# EasyEDA Pro project 减速无刷电机FOC1.0.epro, schematic Schematic1
Create Date: 2024-04-05; Page Name: P1; Project Name: 减速无刷电机FOC; Schematic Name: Schematic1; Update Date: 2024-04-06; Company: 嘉立创EDA; Page Size: A3; Version: V1.0
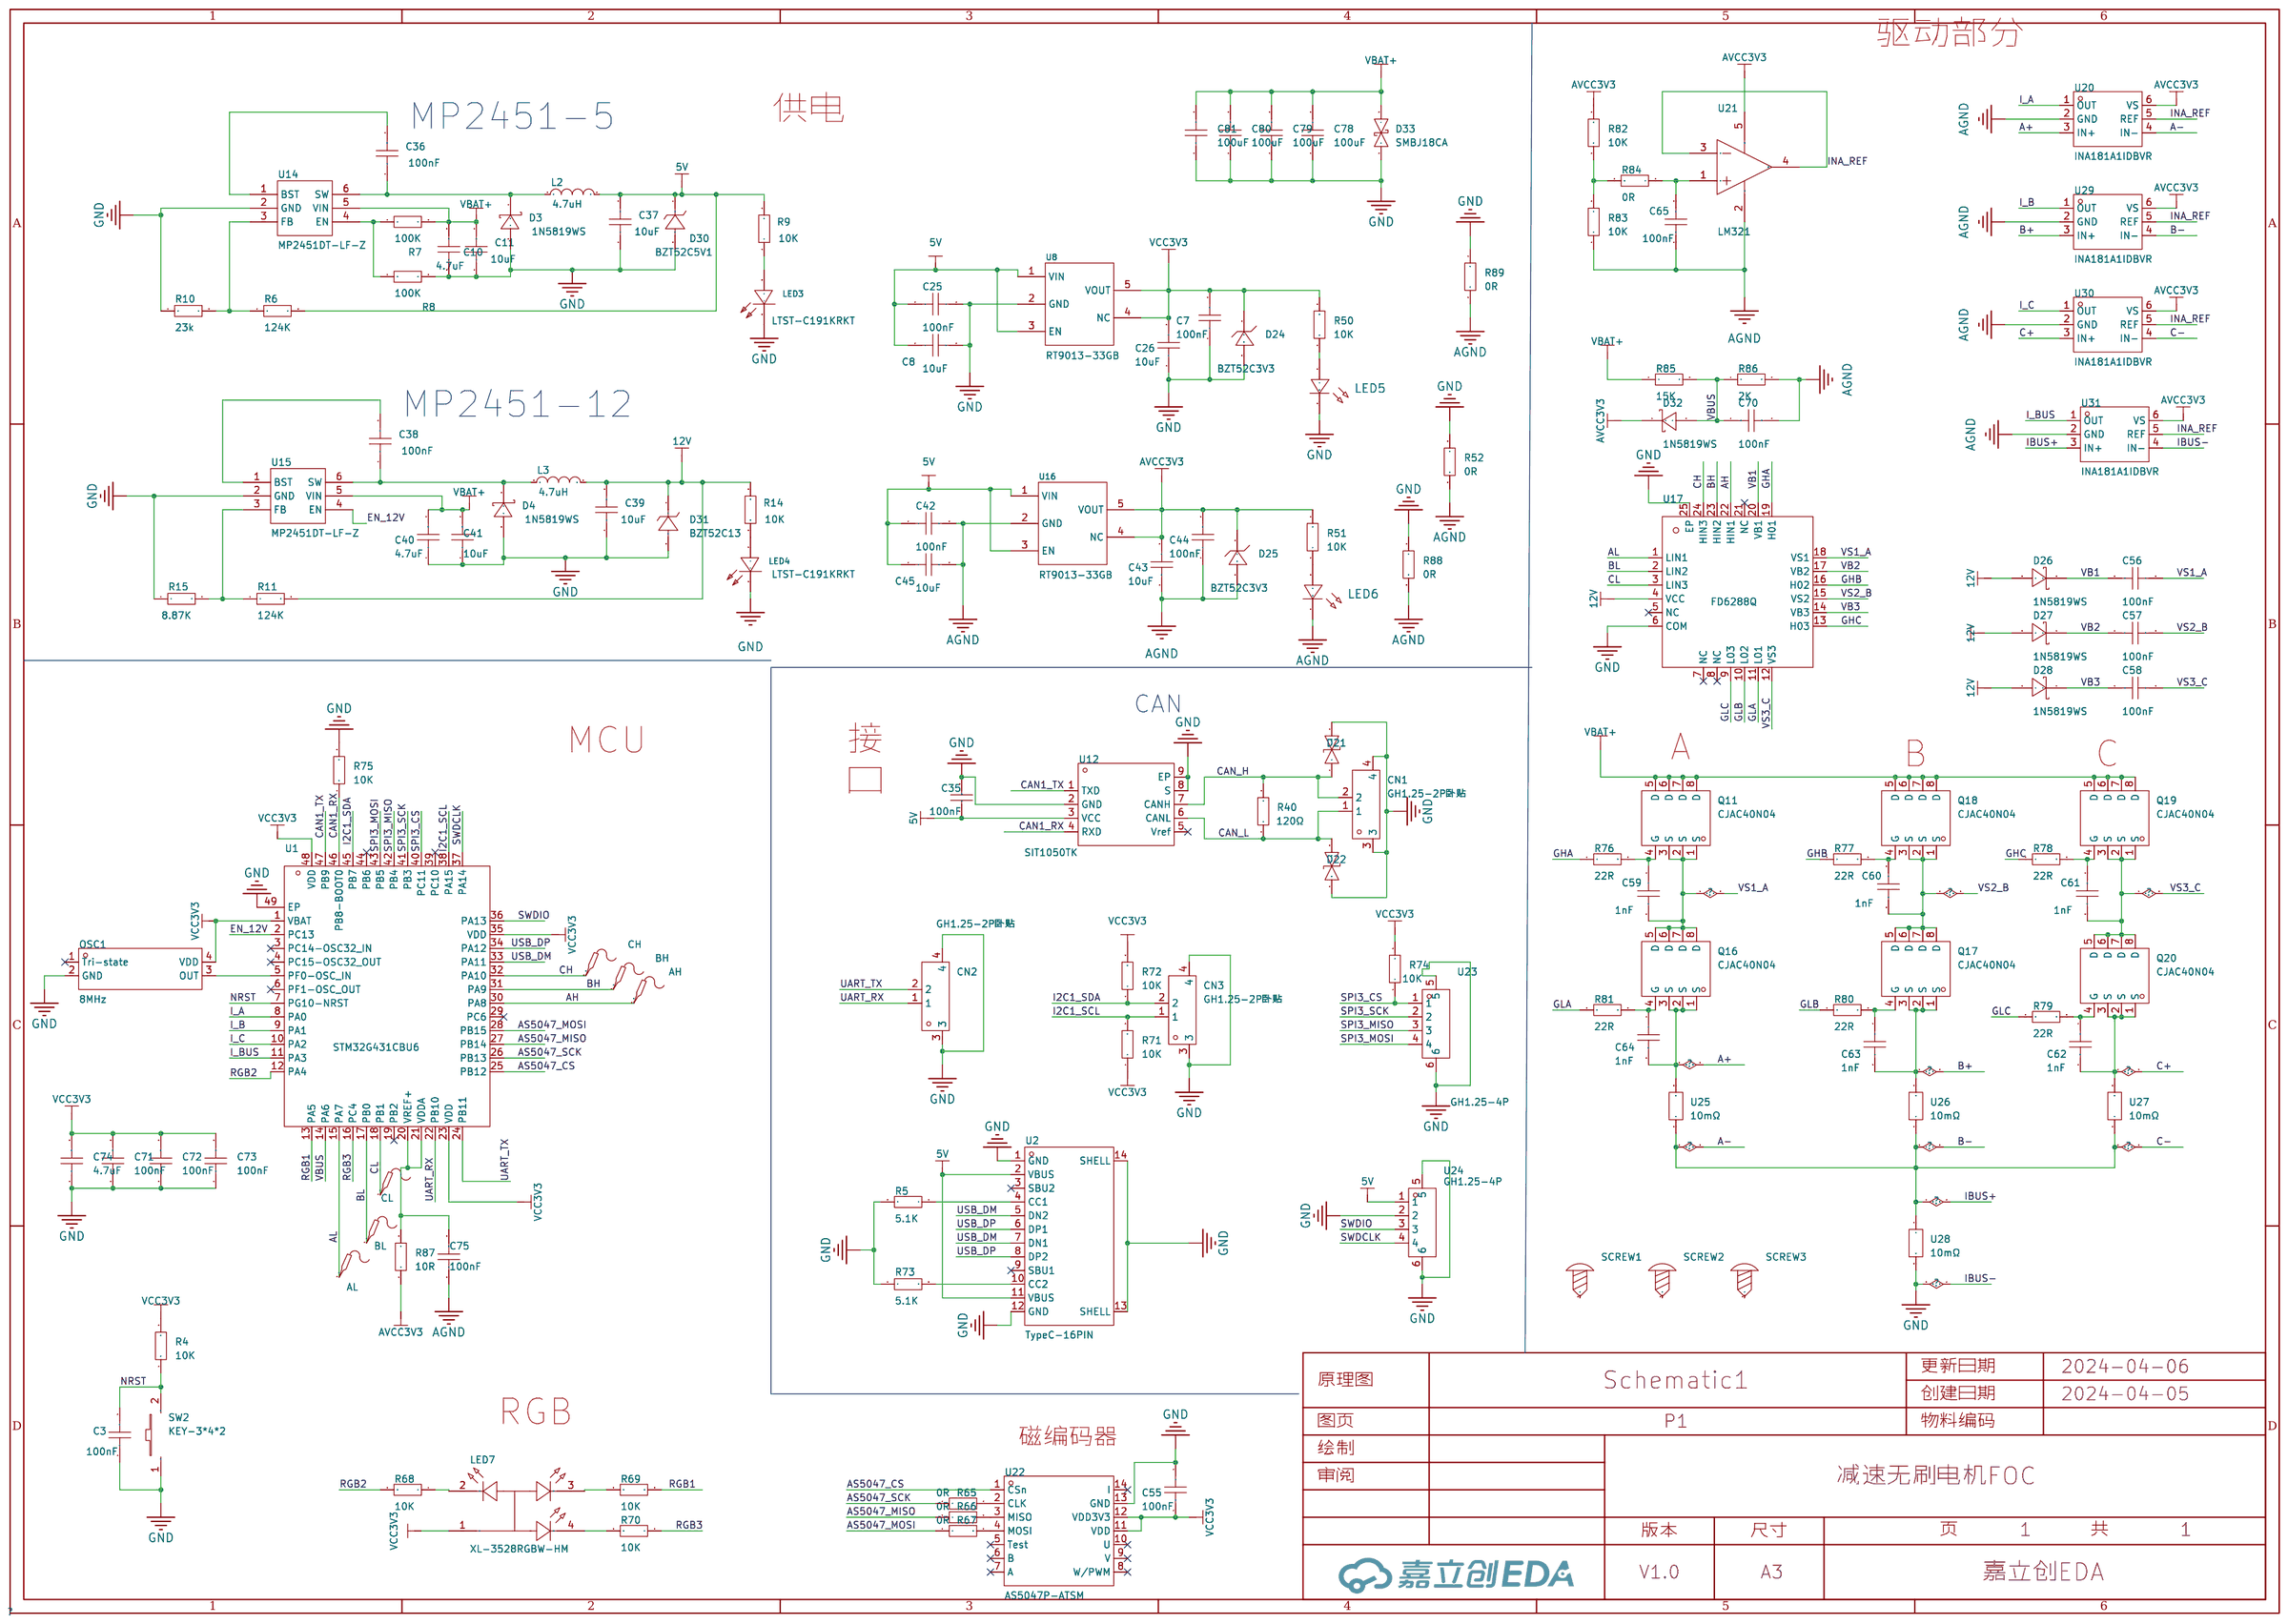
[diagram p0: schematic sheet]

## Parts
AH  -  [Test-Point-0.5mm]
AL  -  [Test-Point-0.5mm]
BH  -  [Test-Point-0.5mm]
BL  -  [Test-Point-0.5mm]
C3  100nF  [C0402]
C7  100nF  [C0603]
C8  10uF  [C0603]
C10  4.7uF  [C0603]
C11  10uF  [C0603]
C25  100nF  [C0603]
C26  10uF  [C0603]
C35  100nF  [C0603]
C36  100nF  [C0603]
C37  10uF  [C0603]
C38  100nF  [C0603]
C39  10uF  [C0603]
C40  4.7uF  [C0603]
C41  10uF  [C0603]
C42  100nF  [C0603]
C43  10uF  [C0603]
C44  100nF  [C0603]
C45  10uF  [C0603]
C55  100nF  [C0603]
C56  100nF  [C0603]
C57  100nF  [C0603]
C58  100nF  [C0603]
C59  1nF  [C0603]
C60  1nF  [C0603]
C61  1nF  [C0603]
C62  1nF  [C0603]
C63  1nF  [C0603]
C64  1nF  [C0603]
C65  100nF  [C0603]
C70  100nF  [C0603]
C71  100nF  [C0402]
C72  100nF  [C0402]
C73  100nF  [C0402]
C74  4.7uF  [C0402]
C75  100nF  [C0402]
C78  100uF  [C1206]
C79  100uF  [C1206]
C80  100uF  [C1206]
C81  100uF  [C1206]
CH  -  [Test-Point-0.5mm]
CL  -  [Test-Point-0.5mm]
CN1  GH1.25-2P卧贴  [CONN-SMD_2P-P1.25_X1251WRS-02HF-LPSW]
CN2  GH1.25-2P卧贴  [CONN-SMD_2P-P1.25_X1251WRS-02HF-LPSW]
CN3  GH1.25-2P卧贴  [CONN-SMD_2P-P1.25_X1251WRS-02HF-LPSW]
D3  1N5819WS  [SOD-323_L1.8-W1.3-LS2.5-RD]
D4  1N5819WS  [SOD-323_L1.8-W1.3-LS2.5-RD]
D21  PESD3V3L1BA-N  [SOD-323_L1.8-W1.3-LS2.5-BI]
D22  PESD3V3L1BA-N  [SOD-323_L1.8-W1.3-LS2.5-BI]
D24  BZT52C3V3  [SOD-123_L2.7-W1.6-LS3.7-RD-1]
D25  BZT52C3V3  [SOD-123_L2.7-W1.6-LS3.7-RD-1]
D26  1N5819WS  [SOD-323_L1.8-W1.3-LS2.5-RD]
D27  1N5819WS  [SOD-323_L1.8-W1.3-LS2.5-RD]
D28  1N5819WS  [SOD-323_L1.8-W1.3-LS2.5-RD]
D30  BZT52C5V1  [SOD-123_L2.8-W1.8-LS3.7-RD-1]
D31  BZT52C13  [SOD-123_L2.7-W1.6-LS3.7-RD-1]
D32  1N5819WS  [SOD-323_L1.8-W1.3-LS2.5-RD]
D33  SMBJ18CA  [SMB_L4.6-W3.6-LS5.3-BI]
L2  4.7uH  [IND-SMD_L5.2-W4.7_GPSR0520]
L3  4.7uH  [IND-SMD_L5.2-W4.7_GPSR0520]
LED3  LTST-C191KRKT  [LED0603-RD]
LED4  LTST-C191KRKT  [LED0603-RD]
LED5  -  [LED_0402]
LED6  -  [LED_0402]
LED7  XL-3528RGBW-HM  [LED-SMD_4P-L3.2-W2.8-LS3.5-BL-CW]
OSC1  8MHz  [OSC-SMD_4P-L3.2-W2.5-BL-1]
Q11  CJAC40N04  [CY_PDFNWB-8L_L5.8-W4.9-P1.27-BL-EP]
Q16  CJAC40N04  [CY_PDFNWB-8L_L5.8-W4.9-P1.27-BL-EP]
Q17  CJAC40N04  [CY_PDFNWB-8L_L5.8-W4.9-P1.27-BL-EP]
Q18  CJAC40N04  [CY_PDFNWB-8L_L5.8-W4.9-P1.27-BL-EP]
Q19  CJAC40N04  [CY_PDFNWB-8L_L5.8-W4.9-P1.27-BL-EP]
Q20  CJAC40N04  [CY_PDFNWB-8L_L5.8-W4.9-P1.27-BL-EP]
R4  10K  [R0402]
R5  5.1K  [R0603]
R6  124K  [R0603]
R7  100K  [R0603]
R8  100K  [R0603]
R9  10K  [R0603]
R10  23k  [R0603]
R11  124K  [R0603]
R14  10K  [R0603]
R15  8.87K  [R0603]
R40  120Ω  [R0603]
R50  10K  [R0402]
R51  10K  [R0402]
R52  0R  [R0402]
R65  0R  [R0402]
R66  0R  [R0402]
R67  0R  [R0402]
R68  10K  [R0402]
R69  10K  [R0402]
R70  10K  [R0402]
R71  10K  [R0603]
R72  10K  [R0603]
R73  5.1K  [R0603]
R74  10K  [R0603]
R75  10K  [R0603]
R76  22R  [R0603]
R77  22R  [R0603]
R78  22R  [R0603]
R79  22R  [R0603]
R80  22R  [R0603]
R81  22R  [R0603]
R82  10K  [R0603]
R83  10K  [R0603]
R84  0R  [R0603]
R85  15K  [R0603]
R86  2K  [R0603]
R87  10R  [R0402]
R88  0R  [R0402]
R89  0R  [R0402]
SCREW1  -  [M3螺丝]
SCREW2  -  [M3螺丝]
SCREW3  -  [M3螺丝]
SW2  KEY-3*4*2  [SW-SMD_L4.0-W2.9-LS5.0]
U1  STM32G431CBU6  [UFQFPN-48_L7.0-W7.0-P0.50-BL-EP]
U2  TypeC-16PIN  [USB-C-SMD_TYPE-C-6PIN-2MD-073]
U8  RT9013-33GB  [SOT-23-5_L3.0-W1.7-P0.95-LS2.8-BL]
U12  SIT1050TK  [TDFN-8_L3.0-W3.0-P0.65-BL-EP]
U14  MP2451DT-LF-Z  [SOT-23-6_L2.9-W1.6-P0.95-LS2.8-BR]
U15  MP2451DT-LF-Z  [SOT-23-6_L2.9-W1.6-P0.95-LS2.8-BR]
U16  RT9013-33GB  [SOT-23-5_L3.0-W1.7-P0.95-LS2.8-BL]
U17  FD6288Q  [QFN-24_L4.0-W4.0-P0.50-BL-EP2.7]
U20  INA181A1IDBVR  [SOT-23-6_L2.9-W1.6-P0.95-LS2.8-TL]
U21  LM321  [SOT-23-5_L2.9-W1.6-P0.95-LS2.8-BR]
U22  AS5047P-ATSM  [TSSOP-14_L5.0-W4.4-P0.65-LS6.4-BL]
U23  GH1.25-4P  [CONN-SMD_GH1.25-4P]
U24  GH1.25-4P  [CONN-SMD_GH1.25-4P]
U25  10mΩ  [R1206]
U26  10mΩ  [R1206]
U27  10mΩ  [R1206]
U28  10mΩ  [R1206]
U29  INA181A1IDBVR  [SOT-23-6_L2.9-W1.6-P0.95-LS2.8-TL]
U30  INA181A1IDBVR  [SOT-23-6_L2.9-W1.6-P0.95-LS2.8-TL]
U31  INA181A1IDBVR  [SOT-23-6_L2.9-W1.6-P0.95-LS2.8-TL]

## Library data of the parts
AH AL BH BL CH CL = Test-Point: Test Point 测试点
C3 C71-C75 = CAP_0402: Supplier Footprint: 0402
C7 C8 C10 C11 C25 C26 C36-C45 C55-C65 C70 = CAP_0603: Supplier Footprint: 0603
C35 = 0603B104K500NT: 容值:100nF;精度:±10%;额定电压:50V;材质(温度系数):X7R;; LCSC Part Name: 100nF ±10% 50V; Supplier Part: C30926; Manufacturer: FH(风华); Supplier Footprint: 0603; JLCPCB Part Class: Extended Part; Datasheet: https://atta.szlcsc.com/upload/public/pdf/source/20200305/C486355_26A10D38EF8C2A5C37091D0039909270.pdf; Supplier: LCSC; Tolerance: ±10%; Voltage Rated: 50V; Temperature Coefficient: X7R
C78-C81 = CAP_1206: Supplier Footprint: 1206
CN1-CN3 = GH1.25-2P卧贴_C9900015099: Supplier Part: C9900015099; JLCPCB Part Class: 扩展库; Supplier: LCSC
D3 D4 D26-D28 D32 = 1N5819WS_C191023: 直流反向耐压(Vr):40V;平均整流电流(Io):1A;正向压降(Vf):600mV@1A;; LCSC Part Name: 40V 1A 600mV@1A; Supplier Part: C191023; Manufacturer: Hottech(合科泰); Supplier Footprint: SOD-323; JLCPCB Part Class: 基础库; Datasheet: https://atta.szlcsc.com/upload/public/pdf/source/20220428/3CB86FD8D28D653594B4E35F9D5AEFD9.pdf; Supplier: LCSC; Reverse Voltage (Vr): 40V; Average Rectified Current (Io): 1A; Forward Voltage (Vf@If): 600mV@1A
D21 D22 = PESD3V3L1BA-N: SOD-323/0805 功率350W VBWM=3.3V 双向 空气30KA 接触30KA; Supplier Part: C316020; Manufacturer: BORN(伯恩半导体); Supplier Footprint: SOD-323; JLCPCB Part Class: 扩展库; Datasheet: https://atta.szlcsc.com/upload/public/pdf/source/20181025/C316020_2B145715011D530A3B5DDCE0F9684BA2.pdf; Supplier: LCSC
D24 D25 = BZT52C3V3: 二极管配置:-;稳压值(标称值):3.3V;稳压值(范围):3.3V~3.5V;功率:500mW;; Supplier Part: C2891770; Manufacturer: YONGYUTAI(永裕泰); Supplier Footprint: SOD-123; JLCPCB Part Class: 扩展库; Datasheet: https://atta.szlcsc.com/upload/public/pdf/source/20210901/8FC2376A01E96D0346FF8B134DC7A446.pdf; Supplier: LCSC; Zener Voltage (Nom): 3.3V; Reverse Leakage Current (Ir): 5uA@1V; Zener Voltage (Range): 3.3V~3.5V; Power Dissipation: 500mW; Zener Impedance (Zzt): 95Ω
D30 = BZT52C5V1_C726995: 稳压值(标称值):5.1V;功率:500mW;精度:-;; Supplier Part: C726995; Manufacturer: TWGMC(台湾迪嘉); Supplier Footprint: SOD-123; Datasheet: https://atta.szlcsc.com/upload/public/pdf/source/20200825/C726987_AA6CB64B7861C942BF0EE5963BB1FA70.pdf; Supplier: LCSC; Zener Voltage (Nom): 5.1V; Reverse Leakage Current (Ir): 2uA@2V; Power Dissipation: 500mW
D31 = BZT52C13_C511893: 二极管配置:独立式;稳压值(标称值):13V;稳压值(范围):12.4V~14.1V;功率:500mW;精度:-;; Supplier Part: C511893; Manufacturer: BORN(伯恩半导体); Supplier Footprint: SOD-123; Datasheet: https://atta.szlcsc.com/upload/public/pdf/source/20180820/C271262_D2D0F24DD5A81EAE2A6B8B493A94E64A.pdf; Supplier: LCSC; Diode Configuration: 独立式; Zener Voltage (Nom): 13V; Reverse Leakage Current (Ir): 100nA@8V; Zener Voltage (Range): 12.4V~14.1V; Power Dissipation: 500mW; Zener Impedance (Zzt): 30Ω
D33 = SMBJ18CA: 反向截止电压(Vrwm):18V;最大钳位电压:29.2V;峰值脉冲电流(Ipp)@10/1000us:20.6A;击穿电压:20V;; Supplier Part: C330065; Manufacturer: JJW(捷捷微); Supplier Footprint: SMB; JLCPCB Part Class: 扩展库; Datasheet: https://atta.szlcsc.com/upload/public/pdf/source/20181224/C338783_C30EB8BBB8C528D881F4F6A96936F798.pdf; Supplier: LCSC; Reverse Stand-Off Voltage (Vrwm): 18V; Maximum Clamping Voltage: 29.2V; Peak Pulse Current (Ipp)@10/1000us: 20.6A; Breakdown Voltage: 20V; Type: TVS
L2 L3 = GPSR0520-4R7M: 电感值:4.7uH;精度:±20%;额定电流:3.2A;; LCSC Part Name: 4.7uH ±20% 3.2A 68mΩ AEC-Q200 车规级一体成型模压电感 SGTE; Supplier Part: C477157; Manufacturer: Gantong(感通); Supplier Footprint: SMD; JLCPCB Part Class: 扩展库; Datasheet: https://atta.szlcsc.com/upload/public/pdf/source/20200331/C477151_65EF27273CBC45D39FA7B5495F8A6275.pdf; Supplier: LCSC; Tolerance: ±20%; Rated Current: 3.2A; DC Resistance (DCR): 68mΩ
LED3 LED4 = LTST-C191KRKT: 发光颜色:红灯;二极管配置:-;透镜颜色:无色透明;主波长:631nm;色温:-;功率:75mW;发光角度:130°;安装方式:-;工作温度:-55℃~+85℃;; LCSC Part Name: 红灯; Supplier Part: C125099; Manufacturer: LITEON(光宝); Supplier Footprint: 0603; JLCPCB Part Class: 扩展库; Datasheet: https://atta.szlcsc.com/upload/public/pdf/source/20180129/C125099_15171878294931315872.pdf; Supplier: LCSC; Emitted Color: 红灯; Lens Color: 无色透明; Dominant Wavelength: 631nm; Peak Wavelength: 639nm; Forward Current: 20mA; Forward Voltage (VF): 2V; Power Dissipation: 75mW; Viewing Angle: 130°; Operating Temperature: -55℃~+85℃
LED5 LED6 = LED_0402-R: Supplier Footprint: 0402
LED7 = XL-3528RGBW-HM: 发光颜色:RGB三色;功率:50mW；50mW；45mW;正向电流:20mA;主波长:618nm~623nm；520nm~525nm；467nm~472nm;二极管配置:-;发光角度:120°;载带方式:正贴;工作温度:-25℃~+80℃;; Supplier Part: C2843813; Manufacturer: XINGLIGHT(成兴光); Supplier Footprint: SMD3528-4P; JLCPCB Part Class: 扩展库; Datasheet: https://atta.szlcsc.com/upload/public/pdf/source/20221102/277CC43588518354A7085EC86A0CE253.pdf; Supplier: LCSC; Emitted Color: RGB三色; Power Dissipation: 50mW；50mW；45mW; Forward Current: 20mA; Dominant Wavelength: 618nm~623nm；520nm~525nm；467nm~472nm; Peak Wavelength: 525nm；623nm；472nm; Viewing Angle: 120°; Mounting Sytle: 正贴; Operating Temperature: -25℃~+80℃
OSC1 = OT2EL4C4JI-111OLP-8M: 频率:8MHz;常温频差:±10ppm;输出模式:CMOS;工作电压:1.8V~3.3V;; LCSC Part Name: 8MHZ?1.8V-3.3V?±10PPM YSO110TR; Supplier Part: C5189450; Manufacturer: YXC(扬兴晶振); Supplier Footprint: SMD3225-4P; Datasheet: https://atta.szlcsc.com/upload/public/pdf/source/20221009/1148DEA51132416CC556CBB25766F9C8.pdf; Supplier: LCSC; Normal temperature Frequency Tolerance: ±10ppm; Output Type: CMOS; Supply Voltage: 1.8V~3.3V; Operating Temperature: -40℃~+85℃
Q11 Q16-Q20 = CJAC40N04: 类型:N沟道;漏源电压(Vdss):40V;连续漏极电流(Id):40A;功率(Pd):4W;导通电阻(RDS(on)@Vgs,Id):7.2mΩ@10V;阈值电压(Vgs(th)@Id):2.5V;; LCSC Part Name: N沟道 耐压:40V 电流:40A; Supplier Part: C504090; Manufacturer: CJ(江苏长电/长晶); Supplier Footprint: PDFNWB-8L-EP(5x6); JLCPCB Part Class: 扩展库; Datasheet: https://atta.szlcsc.com/upload/public/pdf/source/20200327/C504090_3F253B0B0A337943A3FB606E3E02D777.pdf; Supplier: LCSC; Type: N沟道; Drain Source Voltage (Vdss): 40V; Continuous Drain Current (Id): 40A; Power Dissipation (Pd): 4W; Drain Source On Resistance (RDS(on)@Vgs,Id): 7.2mΩ@10V; Gate Threshold Voltage (Vgs(th)@Id): 2.5V; Total Gate Charge (Qg@Vgs): 50nC; Input Capacitance (Ciss@Vds): 2nF; Reverse Transfer Capacitance (Crss@Vds): 155pF
R4 R50-R52 R65-R70 R87-R89 = Res_0402: Supplier Footprint: 0402
R5-R11 R14 R15 R71-R86 = Res_0603: Supplier Footprint: 0603
R40 = 0603WAF1200T5E: 阻值:120Ω;精度:±1%;功率:100mW;温度系数:±100ppm/℃;电阻类型:厚膜电阻;; LCSC Part Name: 120Ω ±1% 100mW 厚膜电阻; Supplier Part: C22787; Manufacturer: UNI-ROYAL(厚声); Supplier Footprint: 0603; JLCPCB Part Class: 基础库; Datasheet: https://atta.szlcsc.com/upload/public/pdf/source/20200306/C422600_1E6D84923E4A46A82E41ADD87F860B5C.pdf; Supplier: LCSC; Tolerance: ±1%; Power(Watts): 100mW; Overload Voltage (Max): 75V; Temperature Coefficient: ±100ppm/℃; Type: 厚膜电阻; Operating Temperature Range: -55℃~+155℃
SCREW1-SCREW3 = M3螺丝: Supplier Footprint: 插件
SW2 = KEY-3*4*2: Supplier Part: C9900015662; Supplier Footprint: KEY; JLCPCB Part Class: 扩展库; Datasheet: https://atta.szlcsc.comnull; Supplier: LCSC
U1 = STM32G431CBU6: CPU内核:ARM-M系列;程序存储容量:128KB;RAM总容量:32KB;GPIO端口数量:42;工作电压范围:1.71V~3.6V;CPU最大主频:170MHz;程序存储器类型:FLASH;; Supplier Part: C529356; Manufacturer: ST(意法半导体); Supplier Footprint: UFQFPN-48(7x7); JLCPCB Part Class: 扩展库; Datasheet: https://atta.szlcsc.com/upload/public/pdf/source/20200511/C529354_7C66CF00837B904D0C15DCE45B69418C.pdf; Supplier: LCSC; CPU Core: ARM-M系列; Program Storage Size: 128KB; RAM Size: 32KB; GPIO Ports Number: 42; Operating Voltage Range: 1.71V~3.6V; CPU Maximum Speed: 170MHz; Program Memory Type: FLASH; Operating Temperature Range: -40℃~+85℃; ADC (Bit): 12bit; DAC (Bit): 12bit; Peripheral/Function: DMA；PWM; Watchdog: 有; Infrared Data Association: 有; Low-Voltage Detect: 有; Direct Memory Access: 有; Internal Oscillator: 有
U2 = TypeC-16PIN: Supplier Part: C9900016187; JLCPCB Part Class: 扩展库; Datasheet: 2022-04-26/182445A/86ade1b3bc5841688e69f2c7e7e4613d/TYPEC母座.pdf; Supplier: LCSC
U8 U16 = RT9013-33GB: 输出类型:固定;输出极性:正;最大输入电压:5.5V;输出电压:3.3V;输出电流:500mA;电源纹波抑制比(PSRR):50dB@(10kHz);; LCSC Part Name: 输入5.5V 输出3.3V 500mA; Supplier Part: C47773; Manufacturer: RICHTEK(立锜); Supplier Footprint: SOT-23-5; JLCPCB Part Class: 扩展库; Datasheet: https://atta.szlcsc.com/upload/public/pdf/source/20150504/1457707282459.pdf; Supplier: LCSC; Output Type: 固定; Output Polarity: 正; Number of Outputs: 1; Maximum Input Voltage: 5.5V; Output Voltage: 3.3V; Dropout Voltage: 400mV@(500mA); Quiescent Current (Ground Current): 50uA; Output Current: 500mA; Power Supply Rejection Ratio (PSRR): 50dB@(10kHz); Operating Temperature: -40℃~+85℃
U12 = SIT1050TK: 类型:收发器;数据速率:1Mbps;; Supplier Part: C427444; Manufacturer: SIT(芯力特); Supplier Footprint: TDFN-8-EP(3x3); JLCPCB Part Class: 扩展库; Datasheet: https://atta.szlcsc.com/upload/public/pdf/source/20190918/C427444_45D8B7A35B400FE4558CE3481D87E254.pdf; Supplier: LCSC; Type: 收发器; Data Rate: 1Mbps; Supply Voltage: 4.5V~5.5V
U14 U15 = MP2451DT-LF-Z: 最大输入电压:-;可输出电流:-;; Supplier Part: C14123; Supplier Footprint: SOT-23-6; JLCPCB Part Class: 扩展库; Datasheet: https://atta.szlcsc.com/upload/public/pdf/source/20200722/C14123_A1B4D2FF88F8729F8C1A187DEC359FB0.pdf; Supplier: LCSC
U17 = FD6288Q_C97677: Supplier Part: C97677; Supplier Footprint: QFN-24-EP(4x4); JLCPCB Part Class: 扩展库; Supplier: LCSC
U20 U29-U31 = INA181A1IDBVR: 放大器数:单路;; Supplier Part: C2058943; Manufacturer: TI(德州仪器); Supplier Footprint: SOT-23-6; JLCPCB Part Class: 扩展库; Datasheet: https://www.ti.com/cn/lit/gpn/ina2181; Supplier: LCSC; Number of Channels: 单路; Supply Current: 260uA; Operating Temperature: -40℃~+125℃
U21 = LM321: 放大器数:单路;增益带宽积(GBP):1MHz;输入失调电压(Vos):5mV;压摆率(SR):0.4V/us;; Supplier Part: C2829424; Manufacturer: CJ(江苏长电/长晶); Supplier Footprint: SOT-23-5L; JLCPCB Part Class: 扩展库; Supplier: LCSC; Number of Circuits: 单路; Gain Bandwidth Product(GBP): 1MHz; Voltage - Input Offset(Vos): 5mV; Common Mode Rejection Ratio (CMRR): 90dB; Slew Rate(SR): 0.4V/us
U22 = AS5047P-ATSM_C962063: Supplier Part: C962063; Manufacturer: ams(艾迈斯半导体); Supplier Footprint: TSSOP-14; JLCPCB Part Class: 扩展库; Datasheet: https://atta.szlcsc.com/upload/public/pdf/source/20230424/95EDFD761CCFD379FE860E4B35935AF0.pdf; Supplier: LCSC
U23 U24 = GH1.25-4P_C9900006327: Supplier Part: C9900006327; JLCPCB Part Class: 扩展库; Supplier: LCSC
U25-U28 = HoLLR1206-1W-5mR-1%: 电阻类型:采样电阻;阻值:5mΩ;精度:±1%;额定压降:-;功率:1W;温度系数:±50ppm/℃;安装方式:贴片;; LCSC Part Name: 5mΩ ±1% 1W; Supplier Part: C2988648; Manufacturer: Milliohm(毫欧); Supplier Footprint: 1206; Datasheet: https://atta.szlcsc.com/upload/public/pdf/source/20220407/F189C92CC2C10DCB4BF36375122B9E11.pdf; Supplier: LCSC; Type: 采样电阻; Tolerance: ±1%; Power(Watts): 1W; Rated Current: 31.6A; Temperature Coefficient: ±50ppm/℃; Mounting Sytle: 贴片

## Nets
5V: C8.1 C25.1 C35.1 C37.2 C42.1 C45.1 D30.1(K) L2.2 R6.2 R9.2 U2.2(VBUS) U2.11(VBUS) U8.1(VIN) U8.3(EN) U12.3(VCC) U16.1(VIN) U16.3(EN) U24.1
12V: C39.2 D26.2(A) D27.2(A) D28.2(A) D31.1(K) L3.2 R11.2 R14.2 U17.4(VCC)
AGND: C42.2 C43.1 C44.1 C45.2 C65.1 C70.2 C75.1 D25.2 LED6.1(C) R52.2 R83.1 R86.2 R88.2 R89.2 U16.2(GND) U20.2(GND) U21.2(-VS) U29.2(GND) U30.2(GND) U31.2(GND)
AVCC3V3: C43.2 C44.2 D25.1 D32.1(K) R51.2 R82.2 R87.1 U16.4(NC) U16.5(VOUT) U20.6(VS) U21.5(+VS) U29.6(VS) U30.6(VS) U31.6(VS)
GND: C3.1 C7.1 C8.2 C10.1 C11.1 C25.2 C26.1 C35.2 C37.1 C39.1 C40.1 C41.1 C55.2 C71.1 C72.1 C73.1 C74.1 C78.1 C79.1 C80.1 C81.1 CN1.3 CN1.4 CN2.3 CN2.4 CN3.3 CN3.4 D3.2(A) D4.2(A) D21.2 D22.1 D24.2 D30.2(A) D31.2(A) D33.1(K) LED3.1(-) LED4.1(-) LED5.1(C) OSC1.2(GND) R5.2 R8.2 R10.1 R15.1 R52.1 R73.1 R75.2 R88.1 R89.1 SW2.1 U1.49(EP) U2.1(GND) U2.12(GND) U2.13(SHELL) U2.14(SHELL) U8.2(GND) U12.2(GND) U12.8(S) U12.9(EP) U14.2(GND) U15.2(GND) U17.6(COM) U17.25(EP) U22.13(GND) U23.5 U23.6 U24.2 U24.5 U24.6 U28.2 U31.4(IN-)
VBAT+: C10.2 C11.2 C40.2 C41.2 C78.2 C79.2 C80.2 C81.2 D33.2(A) Q11.5(D) Q11.6(D) Q11.7(D) Q11.8(D) Q18.5(D) Q18.6(D) Q18.7(D) Q18.8(D) Q19.5(D) Q19.6(D) Q19.7(D) Q19.8(D) R7.2 R85.1 U14.5(VIN) U15.5(VIN)
VBUS: C70.1 D32.2(A) R85.2 R86.1 U1.14(PA6)
VCC3V3: C7.2 C26.2 C55.1 C71.2 C72.2 C73.2 C74.2 D24.1 LED7.1(+) OSC1.4(VDD) R4.2 R50.2 R71.1 R72.2 R74.2 U1.1(VBAT) U1.23(VDD) U1.35(VDD) U1.48(VDD) U8.4(NC) U8.5(VOUT) U22.11(VDD) U22.12(VDD3V3)
A+: C64.2 Q16.1(S) Q16.2(S) Q16.3(S) U20.3(IN+) U25.2
A-: U20.4(IN-) U25.1 U26.1 U27.1 U28.1 U29.4(IN-) U30.4(IN-) U31.3(IN+)
AH: AH.1 U1.30(PA8) U17.22(HIN1)
AL: AL.1 U1.15(PA7) U17.1(LIN1)
AS5047_CS: U1.25(PB12) U22.1(CSn)
AS5047_MISO: R66.1 U1.27(PB14)
AS5047_MOSI: R67.1 U1.28(PB15)
AS5047_SCK: R65.1 U1.26(PB13)
B+: C63.2 Q17.1(S) Q17.2(S) Q17.3(S) U26.2 U29.3(IN+)
BH: BH.1 U1.31(PA9) U17.23(HIN2)
BL: BL.1 U1.17(PB0) U17.2(LIN2)
C+: C62.2 Q20.1(S) Q20.2(S) Q20.3(S) U27.2 U30.3(IN+)
CAN1_RX: R75.1 U1.46(PB8-BOOT0) U12.4(RXD)
CAN1_TX: U1.47(PB9) U12.1(TXD)
CAN_H: CN1.2 D21.1 R40.2 U12.7(CANH)
CAN_L: CN1.1 D22.2 R40.1 U12.6(CANL)
CH: CH.1 U1.32(PA10) U17.24(HIN3)
CL: CL.1 U1.18(PB1) U17.3(LIN3)
EN_12V: U1.2(PC13) U15.4(EN)
GHA: R76.1 U17.19(H01)
GHB: R77.1 U17.16(H02)
GHC: R78.1 U17.13(H03)
GLA: R81.1 U17.11(L01)
GLB: R80.1 U17.10(L02)
GLC: R79.1 U17.9(L03)
I2C1_SCL: CN3.1 R71.2 U1.38(PA15)
I2C1_SDA: CN3.2 R72.1 U1.45(PB7)
I_A: U1.8(PA0) U20.1(OUT)
I_B: U1.9(PA1) U29.1(OUT)
I_BUS: U1.11(PA3) U31.1(OUT)
I_C: U1.10(PA2) U30.1(OUT)
INA_REF: U20.5(REF) U21.3(-IN) U21.4(OUT) U29.5(REF) U30.5(REF) U31.5(REF)
NRST: C3.2 R4.1 SW2.2 U1.7(PG10-NRST)
RGB1: R69.2 U1.13(PA5)
RGB2: R68.2 U1.12(PA4)
RGB3: R70.1 U1.16(PC4)
SPI3_CS: R74.1 U1.40(PC11) U23.1
SPI3_MISO: U1.42(PB4) U23.3
SPI3_MOSI: U1.43(PB5) U23.4
SPI3_SCK: U1.41(PB3) U23.2
SWDCLK: U1.37(PA14) U24.4
SWDIO: U1.36(PA13) U24.3
UART_RX: CN2.1 U1.22(PB10)
UART_TX: CN2.2 U1.24(PB11)
USB_DM: U1.33(PA11) U2.5(DN2) U2.7(DN1)
USB_DP: U1.34(PA12) U2.6(DP1) U2.8(DP2)
VB1: C56.1 D26.1(K) U17.20(VB1)
VB2: C57.1 D27.1(K) U17.17(VB2)
VB3: C58.1 D28.1(K) U17.14(VB3)
VS1_A: C56.2 C59.2 Q11.1(S) Q11.2(S) Q11.3(S) Q16.5(D) Q16.6(D) Q16.7(D) Q16.8(D) U17.18(VS1)
VS2_B: C57.2 C60.2 Q17.5(D) Q17.6(D) Q17.7(D) Q17.8(D) Q18.1(S) Q18.2(S) Q18.3(S) U17.15(VS2)
VS3_C: C58.2 C61.2 Q19.1(S) Q19.2(S) Q19.3(S) Q20.5(D) Q20.6(D) Q20.7(D) Q20.8(D) U17.12(VS3)
$1N858: C36.2 U14.1(BST)
$1N859: C36.1 D3.1(K) L2.1 U14.6(SW)
$1N861: R7.1 R8.1 U14.4(EN)
$1N867: R6.1 R10.2 U14.3(FB)
$1N1721: C38.2 U15.1(BST)
$1N1722: C38.1 D4.1(K) L3.1 U15.6(SW)
$1N1725: LED4.2(+) R14.1
$1N1730: R11.1 R15.2 U15.3(FB)
$1N3788: OSC1.3(OUT) U1.5(PF0-OSC_IN)
$1N4148: LED7.2(B-) R68.1
$1N4149: LED7.3(G-) R69.1
$1N4150: LED7.4(R-) R70.2
$1N4337: R5.1 U2.4(CC1)
$1N4338: R73.2 U2.10(CC2)
$1N4538: R65.2 U22.2(CLK)
$1N4547: R66.2 U22.3(MISO)
$1N4548: R67.2 U22.4(MOSI)
$1N7895: C59.1 Q11.4(G) R76.2
$1N8788: C60.1 Q18.4(G) R77.2
$1N9009: C61.1 Q19.4(G) R78.2
$1N9028: C64.1 Q16.4(G) R81.2
$1N9079: C62.1 Q20.4(G) R79.2
$1N9346: C63.1 Q17.4(G) R80.2
$1N10302: C65.2 R84.1 U21.1(+IN)
$1N10398: R82.1 R83.2 R84.2
$1N15712: C75.2 R87.2 U1.20(VREF+) U1.21(VDDA)
Net-(LED3-2): LED3.2(+) R9.1
Net-(LED5-2): LED5.2(A) R50.1
Net-(LED6-2): LED6.2(A) R51.1

Not connected (* = marked no-connect by the designer): OSC1 1(Tri-state)*; SCREW1 1; SCREW2 1; SCREW3 1; U1 3(PC14-OSC32_IN)* 4(PC15-OSC32_OUT)* 6(PF1-OSC_OUT)* 19(PB2)* 29(PC6)* 39(PC10)* 44(PB6)*; U2 3(SBU2)* 9(SBU1)*; U12 5(Vref)*; U17 5(NC)* 7(NC)* 8(NC)* 21(NC)*; U22 5(Test)* 6(B)* 7(A)* 8(W/PWM)* 9(V)* 10(U)* 14(I)*

## Notes on the sheet
- 驱动部分
- 供电
- MP2451-5
- MP2451-12
- CAN
- MCU
- A
- B
- C
- 接
  口
- RGB
- 磁编码器
